# EAGLE design saturnpad (EAGLE 6.5.0)
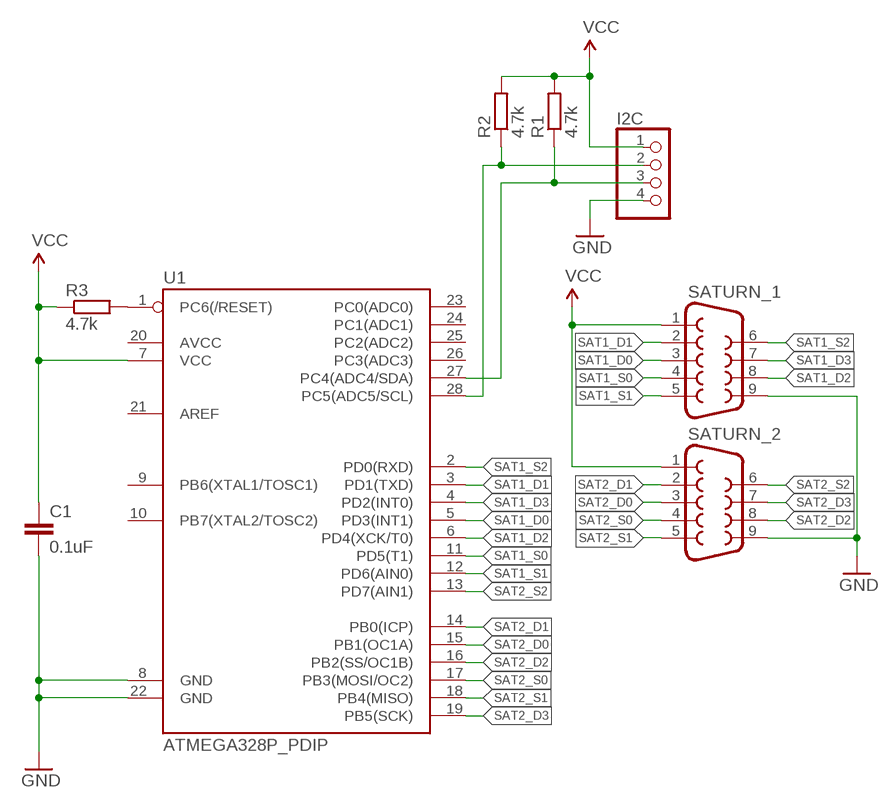
[diagram p0: schematic, sheet 1]

## Parts
C1  0.1uF  C-EU025-030X050  [C025-030X050]
I2C  PINHD-1X4/90  [1X04/90]
R1  4.7k  R-EU_0204/5  [0204/5]
R2  4.7k  R-EU_0204/5  [0204/5]
R3  4.7k  R-EU_0204/5  [0204/5]
SATURN_1  DB9MALE  [DB9_MALE]
SATURN_2  DB9MALE  [DB9_MALE]
U1  ATMEGA328P_PDIP  [DIL28-3]

## Nets
GND: C1.2 I2C.4 SATURN_1.9 SATURN_2.9 U1.8(GND) U1.22(GND)
N$1: I2C.2 R2.1 U1.28(PC5(ADC5/SCL))
N$2: I2C.3 R1.1 U1.27(PC4(ADC4/SDA))
N$3: R3.2 U1.1(PC6(/RESET))
SAT1_D0: SATURN_1.3 U1.5(PD3(INT1))
SAT1_D1: SATURN_1.2 U1.3(PD1(TXD))
SAT1_D2: SATURN_1.8 U1.6(PD4(XCK/T0))
SAT1_D3: SATURN_1.7 U1.4(PD2(INT0))
SAT1_S0: SATURN_1.4 U1.11(PD5(T1))
SAT1_S1: SATURN_1.5 U1.12(PD6(AIN0))
SAT1_S2: SATURN_1.6 U1.2(PD0(RXD))
SAT2_D0: SATURN_2.3 U1.15(PB1(OC1A))
SAT2_D1: SATURN_2.2 U1.14(PB0(ICP))
SAT2_D2: SATURN_2.8 U1.16(PB2(SS/OC1B))
SAT2_D3: SATURN_2.7 U1.19(PB5(SCK))
SAT2_S0: SATURN_2.4 U1.17(PB3(MOSI/OC2))
SAT2_S1: SATURN_2.5 U1.18(PB4(MISO))
SAT2_S2: SATURN_2.6 U1.13(PD7(AIN1))
VCC: C1.1 I2C.1 R1.2 R2.2 R3.1 SATURN_1.1 SATURN_2.1 U1.7(VCC)
Unconnected: U1.9(PB6(XTAL1/TOSC1)) U1.10(PB7(XTAL2/TOSC2)) U1.20(AVCC) U1.21(AREF) U1.23(PC0(ADC0)) U1.24(PC1(ADC1)) U1.25(PC2(ADC2)) U1.26(PC3(ADC3))

## Library data of the parts
C1 = rcl:C-EU: CAPACITOR, European symbol
I2C = pinhead:PINHD-1X4: PIN HEADER
R1-R3 = rcl:R-EU_: RESISTOR, European symbol
SATURN_1 SATURN_2 = SparkFun-Connectors:DB9: DB9 Connector Standard DB9 (D-Sub 9) serial connector. Can be used for CAN bus as well as RS485 and RS232. Footprint production proven. Spark Fun Electronics SKU : PRT-00429
U1 = SparkFun-DigitalIC:ATMEGA328P_PDIP: uC used in the Arduino 32kb flash, 1k EEPROM, 2k SRAM This is the through-hole version of this chip.

## Board
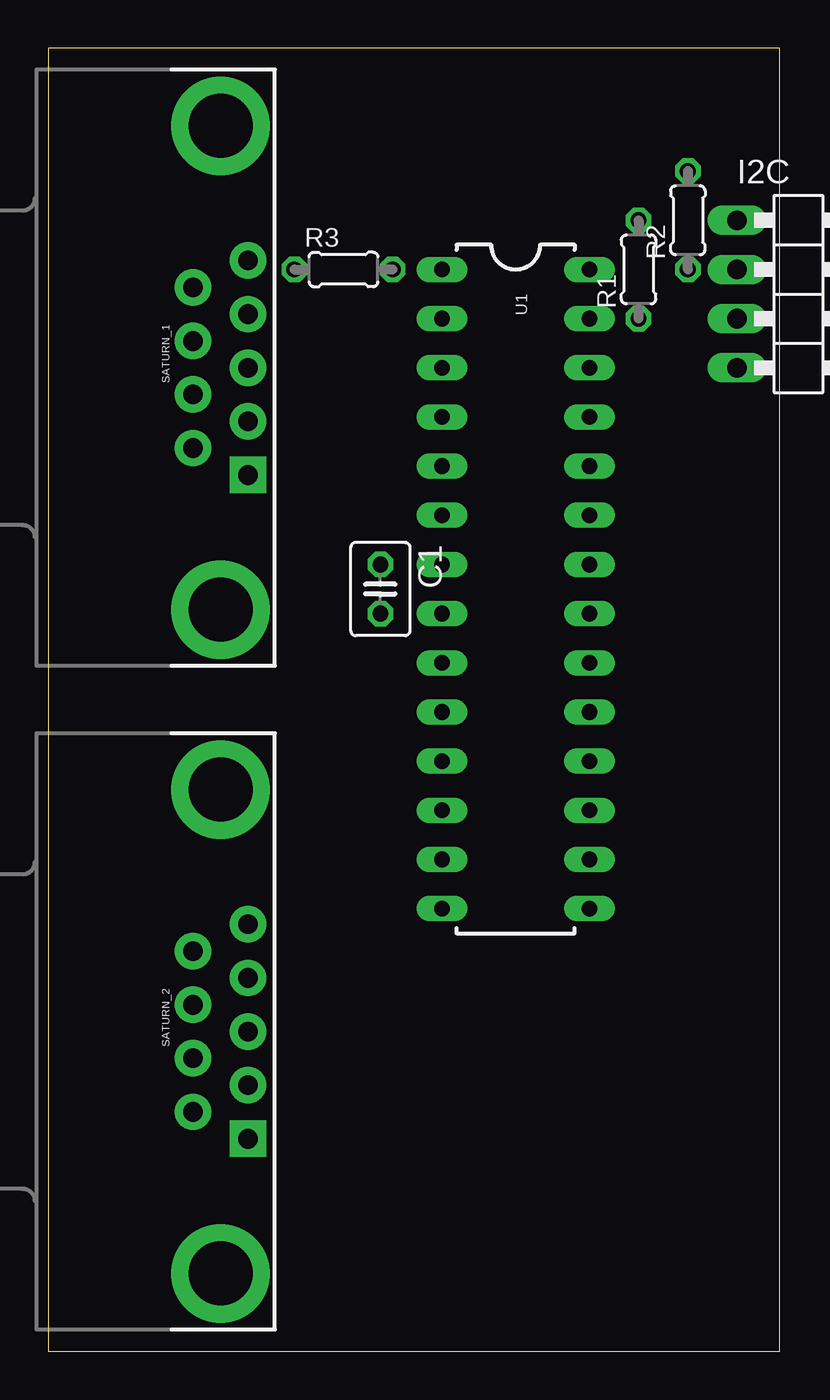
[diagram p1: board, top side]
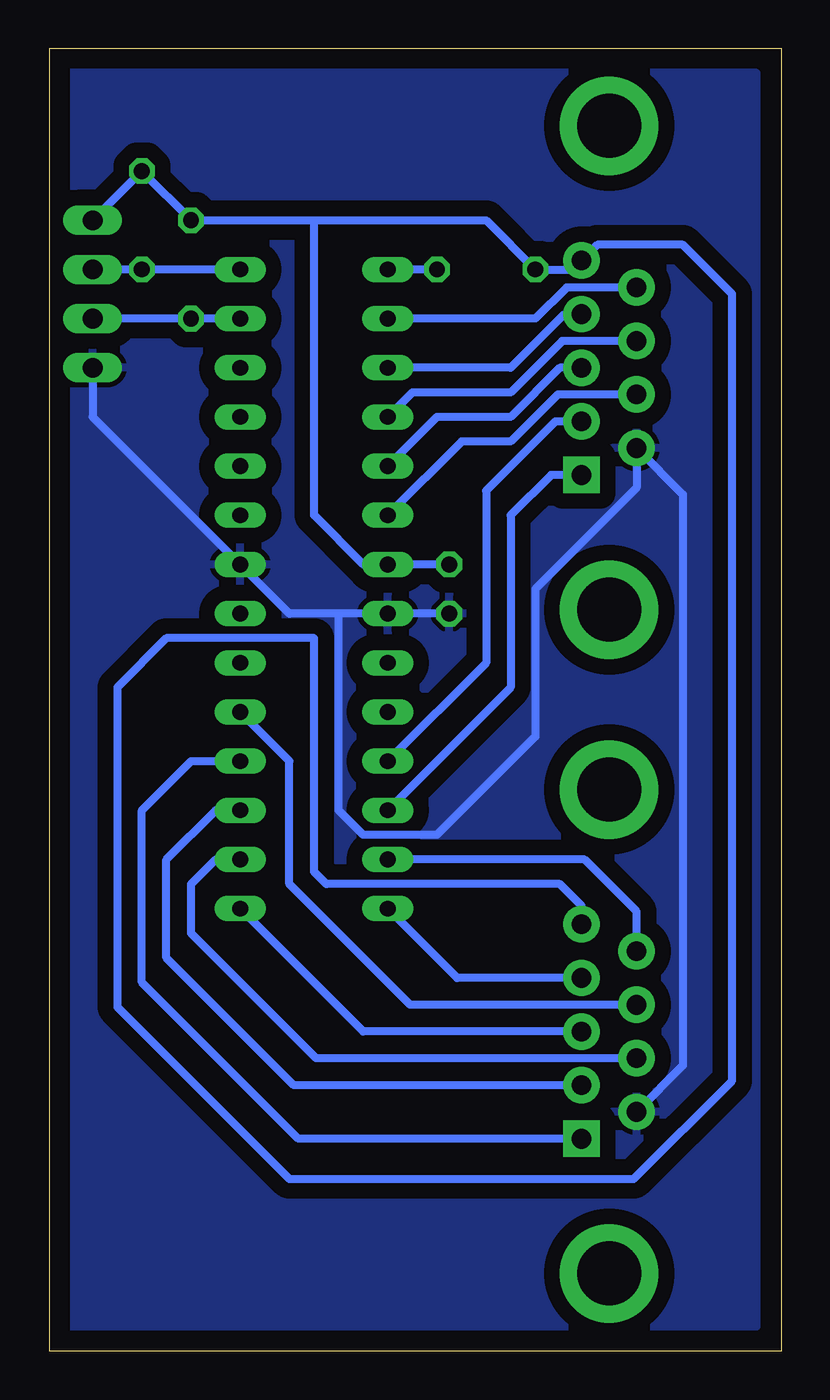
[diagram p2: board, bottom side, seen from below]

Size 37.77 x 67.3 mm. Coordinates in mm from the lower left corner, seen from the top.
Outline: 0,0 37.77,0 37.77,67.3 0,67.3 0,0
Copper layers (1*16): Top 0.035mm / dielectric 1.5mm / Bottom 0.035mm
Design rules "default": minimum track width 10mil, minimum drill 24mil, track to track 8mil, track to pad 8mil, pad to pad 8mil, via to via 8mil, smd to smd 8mil, copper to edge 40mil, drill to drill 8mil, minimum pad ring 10mil, minimum via ring 8mil, stop-mask expansion 4mil, vias tented up to drill 0mil, thermal gap 10mil

### Footprints (pad centres in the part's own frame; a part is rotated, then mirrored left to right if it is on the bottom)
C025-030X050 = drill 0.813 octagon: 1 -1.27,0; 2 1.27,0
1X04/90 = drill 1.016 long: 1 -3.81,-3.81; 2 -1.27,-3.81; 3 1.27,-3.81; 4 3.81,-3.81
0204/5 = drill 0.813 octagon: 1 -2.54,0; 2 2.54,0
DB9_MALE = drill 1.016 pad 1.88: 1 5.54,-1.42; 2 2.77,-1.42; 3 0,-1.42; 4 -2.77,-1.42; 6 4.15,1.42; 7 1.38,1.42; 8 -1.38,1.42; 9 -4.15,1.42 | drill 1.016 pad 1.88 square: 5 -5.54,-1.42 | drill 3.302 pad 5.08: G1 -12.5,0; G2 12.5,0
DIL28-3 = drill 0.813 long: 1 -16.51,-3.81; 2 -13.97,-3.81; 3 -11.43,-3.81; 4 -8.89,-3.81; 5 -6.35,-3.81; 6 -3.81,-3.81; 7 -1.27,-3.81; 8 1.27,-3.81; 9 3.81,-3.81; 10 6.35,-3.81; 11 8.89,-3.81; 12 11.43,-3.81; 13 13.97,-3.81; 14 16.51,-3.81; 15 16.51,3.81; 16 13.97,3.81; 17 11.43,3.81; 18 8.89,3.81; 19 6.35,3.81; 20 3.81,3.81; 21 1.27,3.81; 22 -1.27,3.81; 23 -3.81,3.81; 24 -6.35,3.81; 25 -8.89,3.81; 26 -11.43,3.81; 27 -13.97,3.81; 28 -16.51,3.81

### Placement (x,y rotation side)
C1  17.14,39.37 270 top
I2C  39.37,54.61 270 top
R1  30.48,55.88 90 top
R2  33.02,58.42 90 top
R3  15.24,55.88 0 top
SATURN_1  8.89,50.8 90 top
SATURN_2  8.89,16.51 90 top
U1  24.13,39.37 270 top

### Tracks (layer width: path | path; a pad name or v marks a point on that pad's centre or on a via)
GND
  Bottom 0.406: C1.2 U1.8 22.86,38.1 | SATURN_2.9 5.08,14.75 5.08,44.26 SATURN_1.9 7.47,44.6 12.7,39.37 12.7,31.75 17.78,26.67 21.59,26.67 22.86,27.94 22.86,38.1 | 22.86,38.1 25.4,38.1 U1.22 35.56,48.26 I2C.4
  pour Bottom (isolate 0.813): 1.27,66.04 36.83,66.04 36.83,1.27 1.27,1.27
N$1
  Bottom 0.406: U1.28 R2.1 I2C.2
N$2
  Bottom 0.406: U1.27 R1.1 I2C.3
N$3
  Bottom 0.406: R3.2 U1.1
SAT1_D0
  Bottom 0.406: SATURN_1.3 11.43,50.8 13.97,48.26 17.78,48.26 U1.5
SAT1_D1
  Bottom 0.406: SATURN_1.2 11.2,53.57 13.97,50.8 U1.3
SAT1_D2
  Bottom 0.406: SATURN_1.8 11.54,49.42 13.97,46.99 16.51,46.99 U1.6
SAT1_D3
  Bottom 0.406: SATURN_1.7 11.32,52.18 13.97,49.53 19.05,49.53 U1.4
SAT1_S0
  Bottom 0.406: SATURN_1.4 11.66,48.03 15.24,44.45 15.24,35.56 U1.11
SAT1_S1
  Bottom 0.406: SATURN_1.5 11.89,45.26 13.97,43.18 13.97,34.29 U1.12
SAT1_S2
  Bottom 0.406: SATURN_1.6 11.09,54.95 12.7,53.34 U1.2
SAT2_D0
  Bottom 0.406: SATURN_2.3 21.59,16.51 U1.15
SAT2_D1
  Bottom 0.406: SATURN_2.2 16.74,19.28 U1.14
SAT2_D2
  Bottom 0.406: SATURN_2.8 24.02,15.13 30.48,21.59 30.48,24.13 29.21,25.4 U1.16
SAT2_D3
  Bottom 0.406: SATURN_2.7 19.16,17.89 25.4,24.13 25.4,30.48 U1.19
SAT2_S0
  Bottom 0.406: SATURN_2.4 25.17,13.74 31.75,20.32 31.75,25.4 29.21,27.94 U1.17
SAT2_S1
  Bottom 0.406: SATURN_2.5 24.94,10.97 33.02,19.05 33.02,27.94 30.48,30.48 U1.18
SAT2_S2
  Bottom 0.406: SATURN_2.6 7.47,22.71 10.16,25.4 U1.13
VCC
  Bottom 0.406: U1.7 C1.1 21.59,40.64 24.13,43.18 24.13,58.42 | I2C.1 R2.2 R1.2 24.13,58.42 | 24.13,58.42 15.24,58.42 R3.1 10.77,55.88 SATURN_1.1 9.5,57.15 5.08,57.15 2.54,54.61 2.54,13.97 7.62,8.89 25.4,8.89 34.29,17.78 34.29,34.29 31.75,36.83 24.13,36.83 24.13,24.77 23.5,24.13 11.43,24.13 10.31,23.01 SATURN_2.1